# Altium schematic sheet tie-flash-cfg.SchDoc: CS - Net Tie - Flash
size Letter; CheckedBy: J. Brinton; CompanyName: Signal Laboratories, Inc.; DrawnBy: J. Brinton; Engineer: J. Brinton; Address1: 3479 Edison Way; Address2: Menlo Park CA 94025; Address3: +1 (877) 778-8435; Address4: siglabs.com; Revision: 3; SheetNumber: 23; SheetTotal: 47
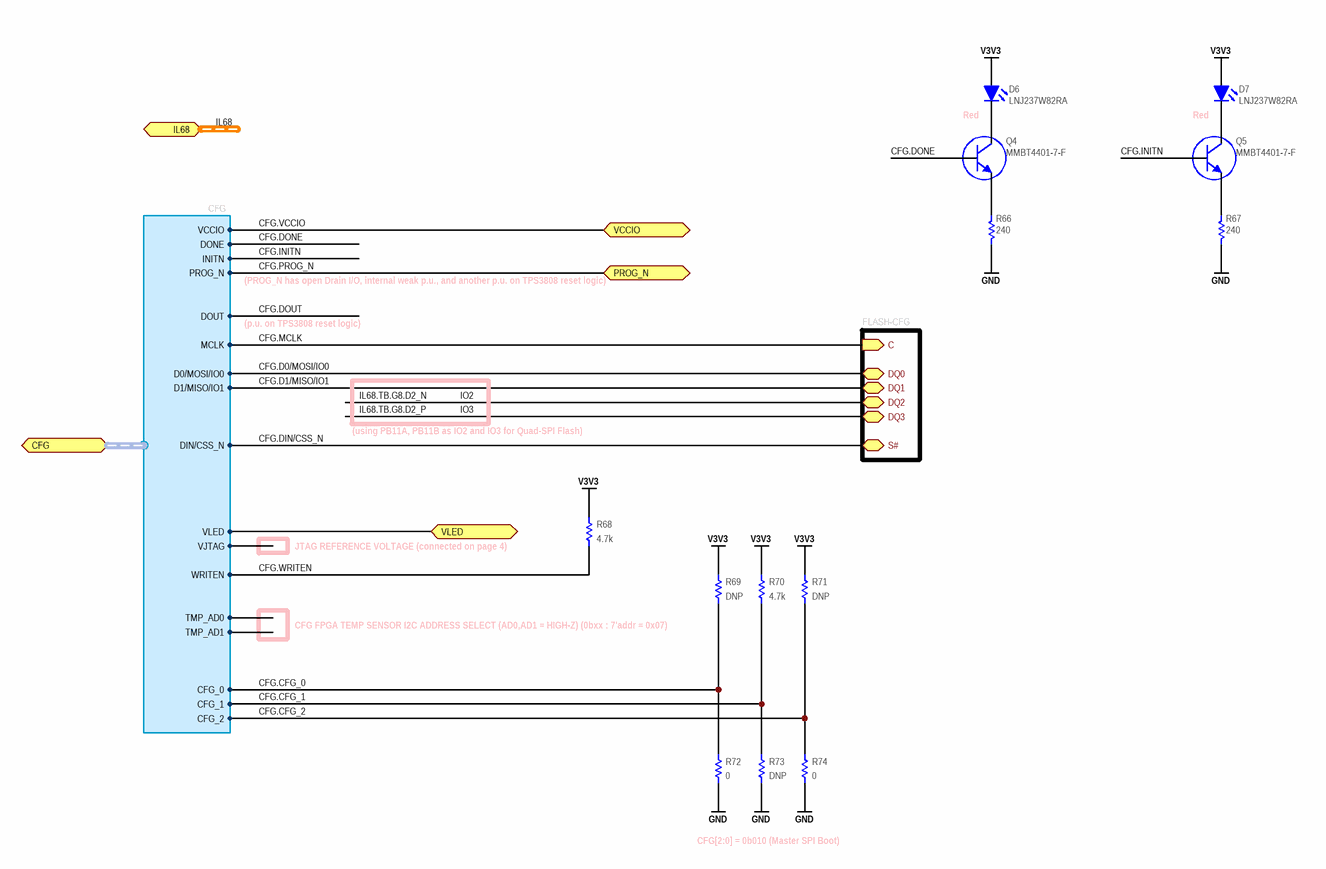
[diagram p0: tie-flash-cfg.SchDoc]

## Parts
D6  LNJ237W82RA  [0603_LED]
D7  LNJ237W82RA  [0603_LED]
Q4  MMBT4401-7-F  [SOT23]
Q5  MMBT4401-7-F  [SOT23]
R66  value 240  [RESC1005X40N]  (hidden comment: ERJ-2RKF2400X)
R67  value 240  [RESC1005X40N]  (hidden comment: ERJ-2RKF2400X)
R68  value 4.7k  [RESC1005X40N]  (hidden comment: ERJ-2RKF4701X)
R69  Do Not Place: DNP  [RESC1608X55N]  (hidden comment: ERJ-3EKF4701V)
R70  value 4.7k  [RESC1608X55N]  (hidden comment: ERJ-3EKF4701V)
R71  Do Not Place: DNP  [RESC1608X55N]  (hidden comment: ERJ-3EKF4701V)
R72  value 0  [RESC1608X55N]  (hidden comment: ERJ-3GEY0R00V)
R73  Do Not Place: DNP  [RESC1608X55N]  (hidden comment: ERJ-3GEY0R00V)
R74  value 0  [RESC1608X55N]  (hidden comment: ERJ-3GEY0R00V)

## Sub-sheets
FLASH-CFG = flash.SchDoc: C (in), DQ0 (bidir), DQ1 (bidir), DQ2 (bidir), DQ3 (bidir), S# (bidir)

## Ports
CFG (harness CFG), IL68 (harness IL), PROG_N (bidir), VCCIO, VLED

## Harnesses
CFG: MCLK, D1/MISO/IO1, D0/MOSI/IO0, DIN/CSS_N, DOUT, PROG_N, DONE, INITN, VCCIO, CFG_0, CFG_1, CFG_2, WRITEN, TMP_AD0, TMP_AD1, VJTAG, VLED

## Nets
GND: R66.2 R67.2 R72.1 R73.1 R74.1
V3V3: D6.1(A) D7.1(A) R68.2 R69.2 R70.2 R71.2
CFG.CFG_0: R69.1 R72.2 ; port CFG.CFG_0
CFG.CFG_1: R70.1 R73.2 ; port CFG.CFG_1
CFG.CFG_2: R71.1 R74.2 ; port CFG.CFG_2
CFG.D0/MOSI/IO0: sheet FLASH-CFG/DQ0, port CFG.D0/MOSI/IO0
CFG.D1/MISO/IO1: sheet FLASH-CFG/DQ1, port CFG.D1/MISO/IO1
CFG.DIN/CSS_N: sheet FLASH-CFG/S#, port CFG.DIN/CSS_N
CFG.DONE: Q4.1(B) ; port CFG.DONE
CFG.DOUT: port CFG.DOUT
CFG.INITN: Q5.1(B) ; port CFG.INITN
CFG.MCLK: sheet FLASH-CFG/C, port CFG.MCLK
CFG.PROG_N: port PROG_N, port CFG.PROG_N
CFG.VCCIO: port VCCIO, port CFG.VCCIO
CFG.WRITEN: R68.1 ; port CFG.WRITEN
IL68.TB.G8.D2_N: sheet FLASH-CFG/DQ2  [also labelled IO2]
IL68.TB.G8.D2_P: sheet FLASH-CFG/DQ3  [also labelled IO3]
VLED: port VLED, port CFG.VLED
NetD6_2: D6.2(K) Q4.3(C)
NetD7_2: D7.2(K) Q5.3(C)
NetQ4_2: Q4.2(E) R66.1
NetQ5_2: Q5.2(E) R67.1

## Buses and harness runs
harness IL68 = port IL68

## Notes on the sheet
- Red
- (p.u. on TPS3808 reset logic)
- (PROG_N has open Drain I/O, internal weak p.u., and another p.u. on TPS3808 reset logic)
- (using PB11A, PB11B as IO2 and IO3 for Quad-SPI Flash)
- JTAG REFERENCE VOLTAGE (connected on page 4)
- (near R69) CFG FPGA TEMP SENSOR I2C ADDRESS SELECT (AD0,AD1 = HIGH-Z) (0bxx : 7'addr = 0x07)
- CFG[2:0] = 0b010 (Master SPI Boot)
- Title
- Engineer
- Revision
- Drawn By
- Checked By
- Date
- Sheet
- of

## Library data of the parts
D6 D7 = LED0603RD: LED, SMT 0603, Color Red, 5mA, 1.85V; Manufacturer: Panasonic; Manufacturer P/N: LNJ237W82RA; Package: 0603 Polarized
Q4 Q5 = MMBT4401-7-F: NPN Small Signal Transistor SMD SOT-23; Manufacturer: Diodes, Inc.; Manufacturer P/N: MMBT4401-7-F
R66 R67 = RES: Thick Film Resistor 240 ±1% 0.1W 75V 0402; Manufacturer: Panasonic; Tcr: ±100; Tr: -55:155; Voltage: 75; Power: 0.1; Tolerance: ±1%; Manufacturer P/N: ERJ-2RKF2400X; Alternatives: *; Footprint: *; Package: 0402
R68 = RES: Thick Film Resistor 4.7k ±1% 0.1W 75V 0402; Manufacturer: Panasonic; Tcr: ±100; Tr: -55:155; Voltage: 75; Power: 0.1; Tolerance: ±1%; Manufacturer P/N: ERJ-2RKF4701X; Alternatives: *; Footprint: *; Package: 0402
R69-R71 = RES: Thick Film Resistor 4.7k ±1% 0.1W 50V 0603; Manufacturer: Panasonic; Tcr: ±100; Tr: -55:155; Voltage: 75; Power: 0.1; Tolerance: ±1%; Manufacturer P/N: ERJ-3EKF4701V; Alternatives: *; Footprint: *; Package: 0603
  R69 R71: Value: 4.7k
R72 R74 = RES: Thick Film Resistor Jumper 0 1A 0603; Manufacturer: Panasonic; Tcr: ±100; Tolerance: ±1%; Tr: -55:155; Voltage: 75; Power: 0.1; Manufacturer P/N: ERJ-3GEY0R00V; Alternatives: *; Footprint: *; Package: 0402
R73 = RES: Thick Film Resistor Jumper 0 1A 0603; Manufacturer: Panasonic; Tcr: ±100; Tolerance: ±1%; Tr: -55:155; Voltage: 75; Power: 0.1; Value: 0; Manufacturer P/N: ERJ-3GEY0R00V; Alternatives: *; Footprint: *; Package: 0402